# Altium schematic sheet GPIO_EXPANDER_LED.SchDoc: My title
size A3; Organization: University of California; Address1: 475 Portola Plaza; Address2: Los Angeles, CA 90095; DocumentNumber: 32; Revision: R01; SheetNumber: 32; SheetTotal: 35
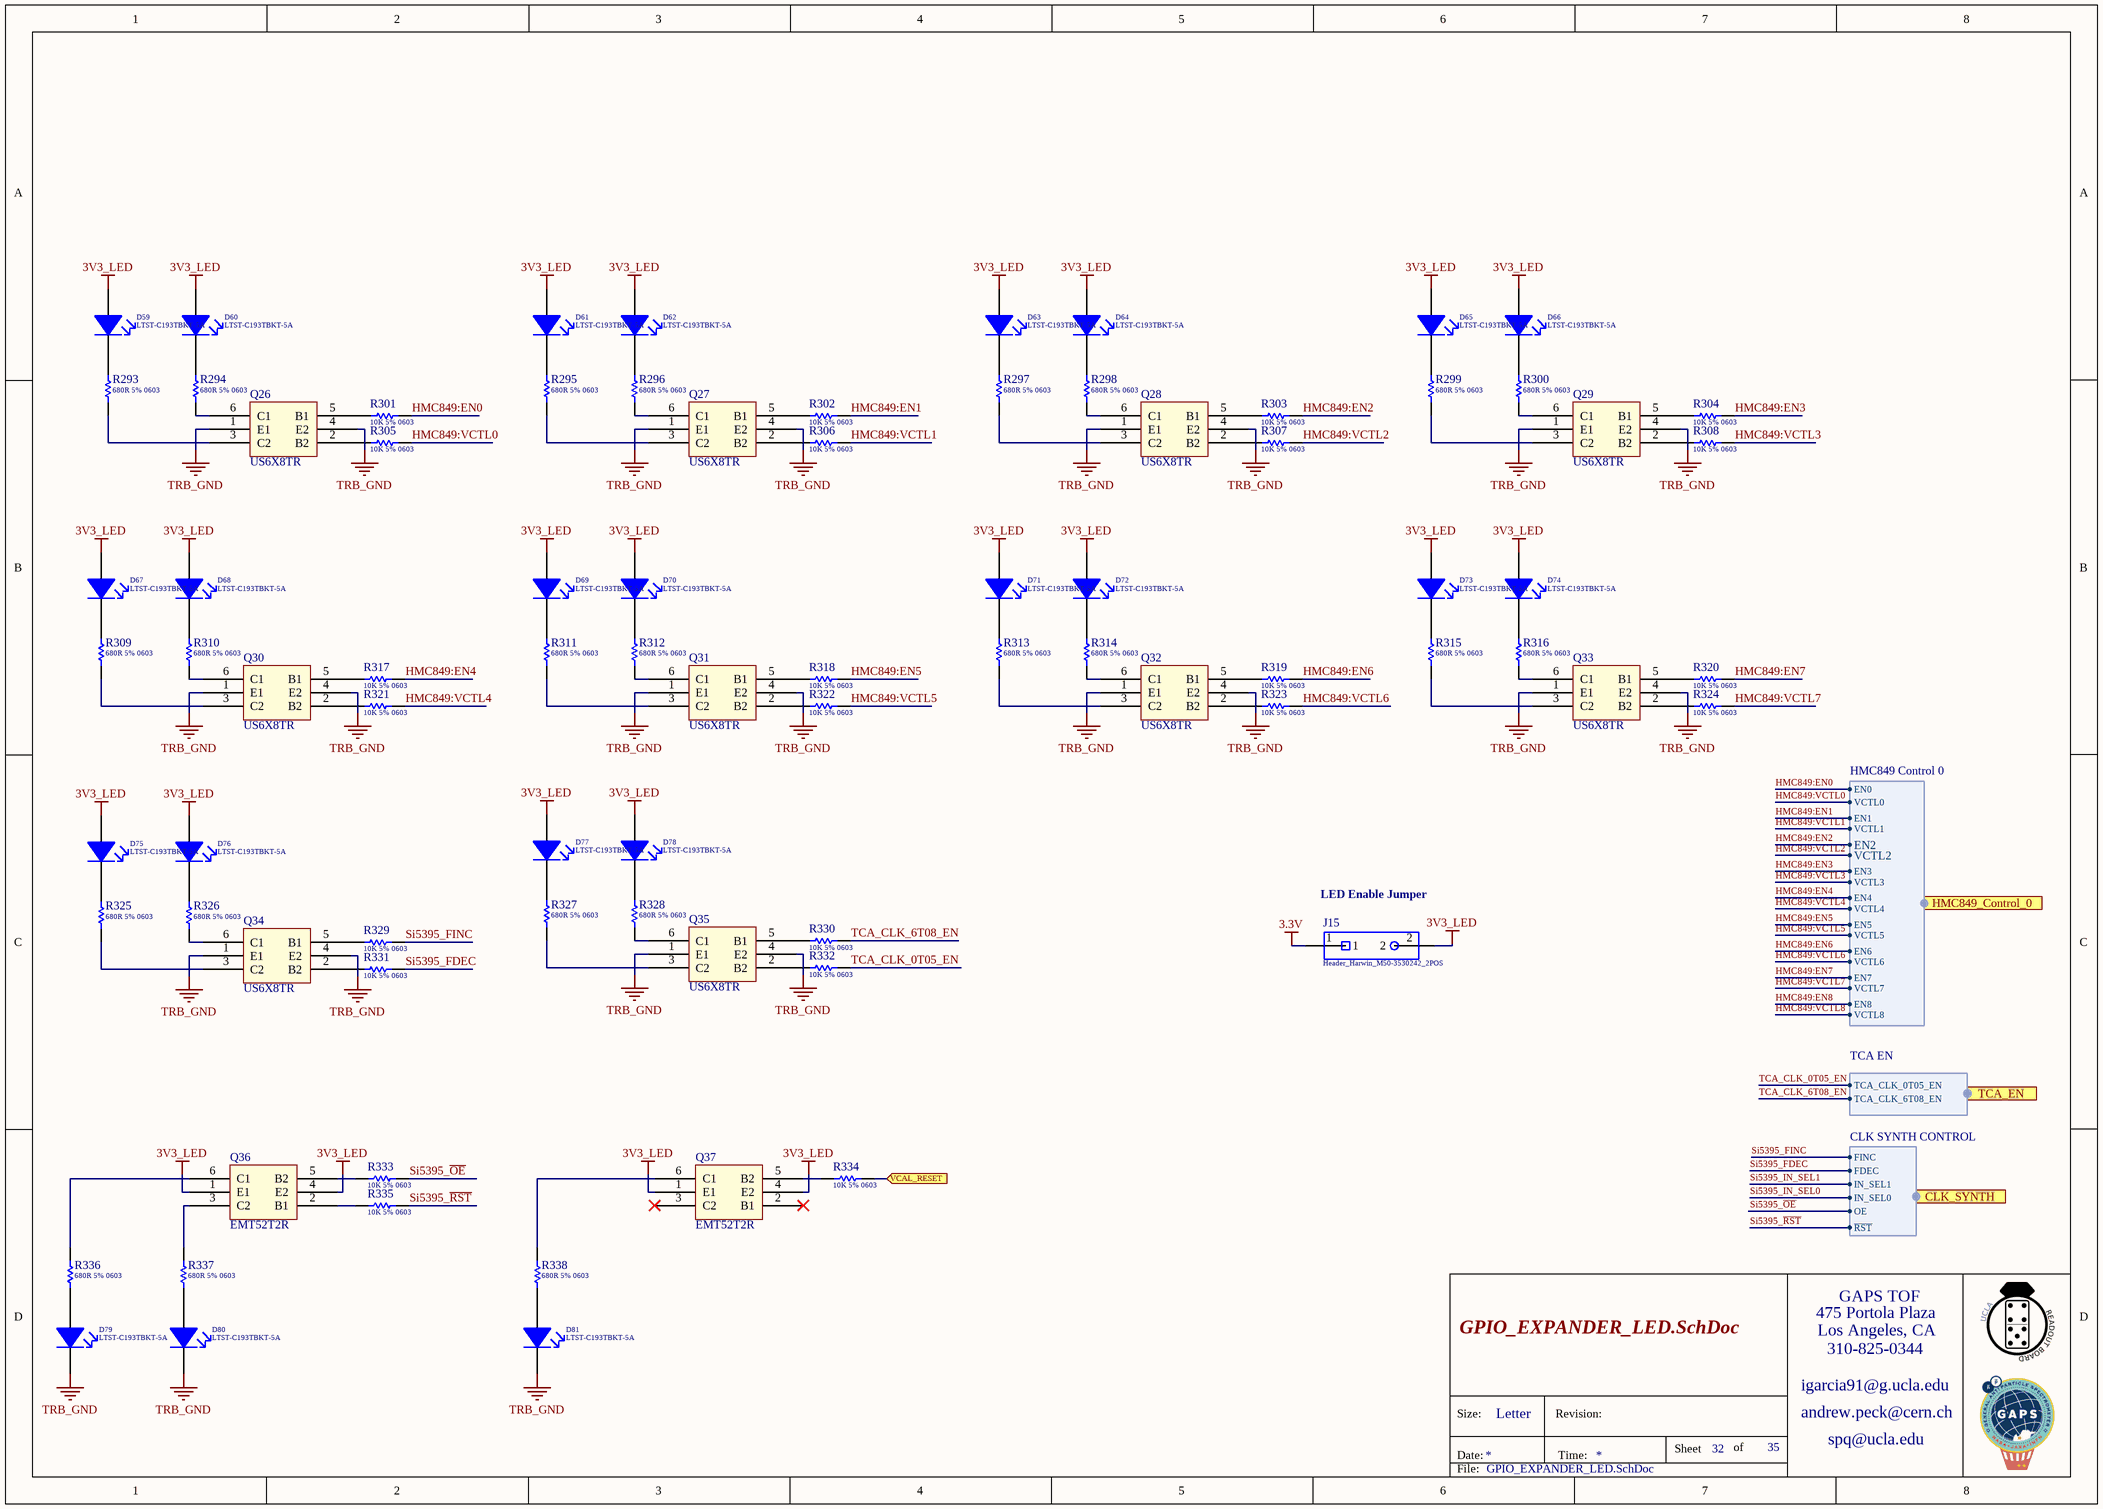
[diagram p0: GPIO_EXPANDER_LED.SchDoc]

## Parts
D59  Series: LTST-C193TBKT-5A  [Led_Lite-On_LTST-C193TBKT-5A_Blue]  (hidden comment: Led_Lite-On_LTST-C193TBKT-5A_Blue)
D60  Series: LTST-C193TBKT-5A  [Led_Lite-On_LTST-C193TBKT-5A_Blue]  (hidden comment: Led_Lite-On_LTST-C193TBKT-5A_Blue)
D61  Series: LTST-C193TBKT-5A  [Led_Lite-On_LTST-C193TBKT-5A_Blue]  (hidden comment: Led_Lite-On_LTST-C193TBKT-5A_Blue)
D62  Series: LTST-C193TBKT-5A  [Led_Lite-On_LTST-C193TBKT-5A_Blue]  (hidden comment: Led_Lite-On_LTST-C193TBKT-5A_Blue)
D63  Series: LTST-C193TBKT-5A  [Led_Lite-On_LTST-C193TBKT-5A_Blue]  (hidden comment: Led_Lite-On_LTST-C193TBKT-5A_Blue)
D64  Series: LTST-C193TBKT-5A  [Led_Lite-On_LTST-C193TBKT-5A_Blue]  (hidden comment: Led_Lite-On_LTST-C193TBKT-5A_Blue)
D65  Series: LTST-C193TBKT-5A  [Led_Lite-On_LTST-C193TBKT-5A_Blue]  (hidden comment: Led_Lite-On_LTST-C193TBKT-5A_Blue)
D66  Series: LTST-C193TBKT-5A  [Led_Lite-On_LTST-C193TBKT-5A_Blue]  (hidden comment: Led_Lite-On_LTST-C193TBKT-5A_Blue)
D67  Series: LTST-C193TBKT-5A  [Led_Lite-On_LTST-C193TBKT-5A_Blue]  (hidden comment: Led_Lite-On_LTST-C193TBKT-5A_Blue)
D68  Series: LTST-C193TBKT-5A  [Led_Lite-On_LTST-C193TBKT-5A_Blue]  (hidden comment: Led_Lite-On_LTST-C193TBKT-5A_Blue)
D69  Series: LTST-C193TBKT-5A  [Led_Lite-On_LTST-C193TBKT-5A_Blue]  (hidden comment: Led_Lite-On_LTST-C193TBKT-5A_Blue)
D70  Series: LTST-C193TBKT-5A  [Led_Lite-On_LTST-C193TBKT-5A_Blue]  (hidden comment: Led_Lite-On_LTST-C193TBKT-5A_Blue)
D71  Series: LTST-C193TBKT-5A  [Led_Lite-On_LTST-C193TBKT-5A_Blue]  (hidden comment: Led_Lite-On_LTST-C193TBKT-5A_Blue)
D72  Series: LTST-C193TBKT-5A  [Led_Lite-On_LTST-C193TBKT-5A_Blue]  (hidden comment: Led_Lite-On_LTST-C193TBKT-5A_Blue)
D73  Series: LTST-C193TBKT-5A  [Led_Lite-On_LTST-C193TBKT-5A_Blue]  (hidden comment: Led_Lite-On_LTST-C193TBKT-5A_Blue)
D74  Series: LTST-C193TBKT-5A  [Led_Lite-On_LTST-C193TBKT-5A_Blue]  (hidden comment: Led_Lite-On_LTST-C193TBKT-5A_Blue)
D75  Series: LTST-C193TBKT-5A  [Led_Lite-On_LTST-C193TBKT-5A_Blue]  (hidden comment: Led_Lite-On_LTST-C193TBKT-5A_Blue)
D76  Series: LTST-C193TBKT-5A  [Led_Lite-On_LTST-C193TBKT-5A_Blue]  (hidden comment: Led_Lite-On_LTST-C193TBKT-5A_Blue)
D77  Series: LTST-C193TBKT-5A  [Led_Lite-On_LTST-C193TBKT-5A_Blue]  (hidden comment: Led_Lite-On_LTST-C193TBKT-5A_Blue)
D78  Series: LTST-C193TBKT-5A  [Led_Lite-On_LTST-C193TBKT-5A_Blue]  (hidden comment: Led_Lite-On_LTST-C193TBKT-5A_Blue)
D79  Series: LTST-C193TBKT-5A  [Led_Lite-On_LTST-C193TBKT-5A_Blue]  (hidden comment: Led_Lite-On_LTST-C193TBKT-5A_Blue)
D80  Series: LTST-C193TBKT-5A  [Led_Lite-On_LTST-C193TBKT-5A_Blue]  (hidden comment: Led_Lite-On_LTST-C193TBKT-5A_Blue)
D81  Series: LTST-C193TBKT-5A  [Led_Lite-On_LTST-C193TBKT-5A_Blue]  (hidden comment: Led_Lite-On_LTST-C193TBKT-5A_Blue)
J15  Header_Harwin_M50-3530242_2POS  [Header_Harwin_M50-3530242_2POS]
Q26  Series: US6X8TR  [BJT_ROHM_US6X8TR_1A_NPN]  (hidden comment: BJT_ROHM_US6X8TR_1A_NPN)
Q27  Series: US6X8TR  [BJT_ROHM_US6X8TR_1A_NPN]  (hidden comment: BJT_ROHM_US6X8TR_1A_NPN)
Q28  Series: US6X8TR  [BJT_ROHM_US6X8TR_1A_NPN]  (hidden comment: BJT_ROHM_US6X8TR_1A_NPN)
Q29  Series: US6X8TR  [BJT_ROHM_US6X8TR_1A_NPN]  (hidden comment: BJT_ROHM_US6X8TR_1A_NPN)
Q30  Series: US6X8TR  [BJT_ROHM_US6X8TR_1A_NPN]  (hidden comment: BJT_ROHM_US6X8TR_1A_NPN)
Q31  Series: US6X8TR  [BJT_ROHM_US6X8TR_1A_NPN]  (hidden comment: BJT_ROHM_US6X8TR_1A_NPN)
Q32  Series: US6X8TR  [BJT_ROHM_US6X8TR_1A_NPN]  (hidden comment: BJT_ROHM_US6X8TR_1A_NPN)
Q33  Series: US6X8TR  [BJT_ROHM_US6X8TR_1A_NPN]  (hidden comment: BJT_ROHM_US6X8TR_1A_NPN)
Q34  Series: US6X8TR  [BJT_ROHM_US6X8TR_1A_NPN]  (hidden comment: BJT_ROHM_US6X8TR_1A_NPN)
Q35  Series: US6X8TR  [BJT_ROHM_US6X8TR_1A_NPN]  (hidden comment: BJT_ROHM_US6X8TR_1A_NPN)
Q36  Series: EMT52T2R  [BJT_ROHM_EMT52T2R_100mA_PNP]  (hidden comment: BJT_ROHM_EMT52T2R_100mA_PNP)
Q37  Series: EMT52T2R  [BJT_ROHM_EMT52T2R_100mA_PNP]  (hidden comment: BJT_ROHM_EMT52T2R_100mA_PNP)
R293  680R 5% 0603  [RESC0603(1608)_L]
R294  680R 5% 0603  [RESC0603(1608)_L]
R295  680R 5% 0603  [RESC0603(1608)_L]
R296  680R 5% 0603  [RESC0603(1608)_L]
R297  680R 5% 0603  [RESC0603(1608)_L]
R298  680R 5% 0603  [RESC0603(1608)_L]
R299  680R 5% 0603  [RESC0603(1608)_L]
R300  680R 5% 0603  [RESC0603(1608)_L]
R301  10K 5% 0603  [RESC0603(1608)_L]
R302  10K 5% 0603  [RESC0603(1608)_L]
R303  10K 5% 0603  [RESC0603(1608)_L]
R304  10K 5% 0603  [RESC0603(1608)_L]
R305  10K 5% 0603  [RESC0603(1608)_L]
R306  10K 5% 0603  [RESC0603(1608)_L]
R307  10K 5% 0603  [RESC0603(1608)_L]
R308  10K 5% 0603  [RESC0603(1608)_L]
R309  680R 5% 0603  [RESC0603(1608)_L]
R310  680R 5% 0603  [RESC0603(1608)_L]
R311  680R 5% 0603  [RESC0603(1608)_L]
R312  680R 5% 0603  [RESC0603(1608)_L]
R313  680R 5% 0603  [RESC0603(1608)_L]
R314  680R 5% 0603  [RESC0603(1608)_L]
R315  680R 5% 0603  [RESC0603(1608)_L]
R316  680R 5% 0603  [RESC0603(1608)_L]
R317  10K 5% 0603  [RESC0603(1608)_L]
R318  10K 5% 0603  [RESC0603(1608)_L]
R319  10K 5% 0603  [RESC0603(1608)_L]
R320  10K 5% 0603  [RESC0603(1608)_L]
R321  10K 5% 0603  [RESC0603(1608)_L]
R322  10K 5% 0603  [RESC0603(1608)_L]
R323  10K 5% 0603  [RESC0603(1608)_L]
R324  10K 5% 0603  [RESC0603(1608)_L]
R325  680R 5% 0603  [RESC0603(1608)_L]
R326  680R 5% 0603  [RESC0603(1608)_L]
R327  680R 5% 0603  [RESC0603(1608)_L]
R328  680R 5% 0603  [RESC0603(1608)_L]
R329  10K 5% 0603  [RESC0603(1608)_L]
R330  10K 5% 0603  [RESC0603(1608)_L]
R331  10K 5% 0603  [RESC0603(1608)_L]
R332  10K 5% 0603  [RESC0603(1608)_L]
R333  10K 5% 0603  [RESC0603(1608)_L]
R334  10K 5% 0603  [RESC0603(1608)_L]
R335  10K 5% 0603  [RESC0603(1608)_L]
R336  680R 5% 0603  [RESC0603(1608)_L]
R337  680R 5% 0603  [RESC0603(1608)_L]
R338  680R 5% 0603  [RESC0603(1608)_L]

## Ports
CLK_SYNTH (harness CLK SYNTH CONTROL), HMC849_Control_0 (harness HMC849 Control 0), TCA_EN (harness TCA EN), VCAL_RESET (in)

## Harnesses
HMC849 Control 0: EN0, VCTL0, EN1, VCTL1, EN2, VCTL2, EN3, VCTL3, EN4, VCTL4, EN5, VCTL5, EN6, VCTL6, EN7, VCTL7, EN8, VCTL8
TCA EN: TCA_CLK_0T05_EN, TCA_CLK_6T08_EN
CLK SYNTH CONTROL: ~{RST}, OE, IN_SEL0, IN_SEL1, FDEC, FINC

## Nets
3.3V: J15.1
3V3_LED: D59.2(A) D60.2(A) D61.2(A) D62.2(A) D63.2(A) D64.2(A) D65.2(A) D66.2(A) D67.2(A) D68.2(A) D69.2(A) D70.2(A) D71.2(A) D72.2(A) D73.2(A) D74.2(A) D75.2(A) D76.2(A) D77.2(A) D78.2(A) J15.2 Q36.1(E1) Q36.4(E2) Q37.1(E1) Q37.4(E2)
TRB_GND: D79.1(K) D80.1(K) D81.1(K) Q26.1(E1) Q26.4(E2) Q27.1(E1) Q27.4(E2) Q28.1(E1) Q28.4(E2) Q29.1(E1) Q29.4(E2) Q30.1(E1) Q30.4(E2) Q31.1(E1) Q31.4(E2) Q32.1(E1) Q32.4(E2) Q33.1(E1) Q33.4(E2) Q34.1(E1) Q34.4(E2) Q35.1(E1) Q35.4(E2)
HMC849:EN0: R301.2 ; port HMC849_Control_0.EN0
HMC849:EN1: R302.2 ; port HMC849_Control_0.EN1
HMC849:EN2: R303.2 ; port HMC849_Control_0.EN2
HMC849:EN3: R304.2 ; port HMC849_Control_0.EN3
HMC849:EN4: R317.2 ; port HMC849_Control_0.EN4
HMC849:EN5: R318.2 ; port HMC849_Control_0.EN5
HMC849:EN6: R319.2 ; port HMC849_Control_0.EN6
HMC849:EN7: R320.2 ; port HMC849_Control_0.EN7
HMC849:EN8: port HMC849_Control_0.EN8
HMC849:VCTL0: R305.1 ; port HMC849_Control_0.VCTL0
HMC849:VCTL1: R306.1 ; port HMC849_Control_0.VCTL1
HMC849:VCTL2: R307.1 ; port HMC849_Control_0.VCTL2
HMC849:VCTL3: R308.1 ; port HMC849_Control_0.VCTL3
HMC849:VCTL4: R321.1 ; port HMC849_Control_0.VCTL4
HMC849:VCTL5: R322.1 ; port HMC849_Control_0.VCTL5
HMC849:VCTL6: R323.1 ; port HMC849_Control_0.VCTL6
HMC849:VCTL7: R324.1 ; port HMC849_Control_0.VCTL7
HMC849:VCTL8: port HMC849_Control_0.VCTL8
Si5395_FDEC: R331.1 ; port CLK_SYNTH.FDEC
Si5395_FINC: R329.2 ; port CLK_SYNTH.FINC
Si5395_IN_SEL0: port CLK_SYNTH.IN_SEL0
Si5395_IN_SEL1: port CLK_SYNTH.IN_SEL1
Si5395_~{OE}: R333.1 ; port CLK_SYNTH.OE
Si5395_~{RST}: R335.2 ; port CLK_SYNTH.~{RST}
TCA_CLK_0T05_EN: R332.1 ; port TCA_EN.TCA_CLK_0T05_EN
TCA_CLK_6T08_EN: R330.2 ; port TCA_EN.TCA_CLK_6T08_EN
VCAL_RESET: R334.1 ; port VCAL_RESET
NetD59_1: D59.1(K) R293.2
NetD60_1: D60.1(K) R294.2
NetD61_1: D61.1(K) R295.2
NetD62_1: D62.1(K) R296.2
NetD63_1: D63.1(K) R297.2
NetD64_1: D64.1(K) R298.2
NetD65_1: D65.1(K) R299.2
NetD66_1: D66.1(K) R300.2
NetD67_1: D67.1(K) R309.2
NetD68_1: D68.1(K) R310.2
NetD69_1: D69.1(K) R311.2
NetD70_1: D70.1(K) R312.2
NetD71_1: D71.1(K) R313.2
NetD72_1: D72.1(K) R314.2
NetD73_1: D73.1(K) R315.2
NetD74_1: D74.1(K) R316.2
NetD75_1: D75.1(K) R325.2
NetD76_1: D76.1(K) R326.2
NetD77_1: D77.1(K) R327.2
NetD78_1: D78.1(K) R328.2
NetD79_2: D79.2(A) R336.1
NetD80_2: D80.2(A) R337.1
NetD81_2: D81.2(A) R338.1
NetQ26_2: Q26.2(B2) R305.2
NetQ26_3: Q26.3(C2) R293.1
NetQ26_5: Q26.5(B1) R301.1
NetQ26_6: Q26.6(C1) R294.1
NetQ27_2: Q27.2(B2) R306.2
NetQ27_3: Q27.3(C2) R295.1
NetQ27_5: Q27.5(B1) R302.1
NetQ27_6: Q27.6(C1) R296.1
NetQ28_2: Q28.2(B2) R307.2
NetQ28_3: Q28.3(C2) R297.1
NetQ28_5: Q28.5(B1) R303.1
NetQ28_6: Q28.6(C1) R298.1
NetQ29_2: Q29.2(B2) R308.2
NetQ29_3: Q29.3(C2) R299.1
NetQ29_5: Q29.5(B1) R304.1
NetQ29_6: Q29.6(C1) R300.1
NetQ30_2: Q30.2(B2) R321.2
NetQ30_3: Q30.3(C2) R309.1
NetQ30_5: Q30.5(B1) R317.1
NetQ30_6: Q30.6(C1) R310.1
NetQ31_2: Q31.2(B2) R322.2
NetQ31_3: Q31.3(C2) R311.1
NetQ31_5: Q31.5(B1) R318.1
NetQ31_6: Q31.6(C1) R312.1
NetQ32_2: Q32.2(B2) R323.2
NetQ32_3: Q32.3(C2) R313.1
NetQ32_5: Q32.5(B1) R319.1
NetQ32_6: Q32.6(C1) R314.1
NetQ33_2: Q33.2(B2) R324.2
NetQ33_3: Q33.3(C2) R315.1
NetQ33_5: Q33.5(B1) R320.1
NetQ33_6: Q33.6(C1) R316.1
NetQ34_2: Q34.2(B2) R331.2
NetQ34_3: Q34.3(C2) R325.1
NetQ34_5: Q34.5(B1) R329.1
NetQ34_6: Q34.6(C1) R326.1
NetQ35_2: Q35.2(B2) R332.2
NetQ35_3: Q35.3(C2) R327.1
NetQ35_5: Q35.5(B1) R330.1
NetQ35_6: Q35.6(C1) R328.1
NetQ36_2: Q36.2(B1) R335.1
NetQ36_3: Q36.3(C2) R337.2
NetQ36_5: Q36.5(B2) R333.2
NetQ36_6: Q36.6(C1) R336.2
NetQ37_5: Q37.5(B2) R334.2
NetQ37_6: Q37.6(C1) R338.2

Not connected (* = marked no-connect by the designer): Q37 2(B1)* 3(C2)*

## Notes on the sheet
- (near J15) LED Enable Jumper
- 475 Portola Plaza
- GAPS TOF
- igarcia91@g.ucla.edu
- Los Angeles, CA
- 310-825-0344
- Size:
- Date:
- Letter
- Revision:
- Time:
- Sheet
- of
- andrew.peck@cern.ch
- spq@ucla.edu
- File:

## Library data of the parts
D59-D81 = Led_Lite-On_LTST-C193TBKT-5A_Blue: Standard LEDs - SMD Blue 470nm 28mcd 20mA; Supplier 1: Mouser; Supplier Part Number 1: 859-LTSTC193TBKT5A
J15 = Header_Harwin_M50-3530242_2POS: Headers & Wire Housings 2 WAY SIL VERT PC TAIL P/HDR; Supplier 1: Mouser; Supplier Part Number 1: 855-M50-3530242
Q26-Q35 = BJT_ROHM_US6X8TR_1A_NPN: Bipolar Transistors - BJT NPN+NPN 30VCEO 1A SOT-363T; Manufacturer 1: ROHM; Supplier Part Number 1: 755-US6X8TR; Supplier 1: Mouser; Manufacturer Part Number 1: US6X8TR
Q36 Q37 = BJT_ROHM_EMT52T2R_100mA_PNP: Bipolar Transistors - BJT Bipolar Transistor SOT-563 SC-107C EMT6; Manufacturer 1: ROHM; Supplier 1: Mouser; Supplier Part Number 1: 755-EMT52T2R; Manufacturer Part Number 1: EMT52T2R
R293-R300 R309-R316 R325-R328 R336-R338 = CMP-1012-00070-1: 680R 0.1W 5% 0603 (1608 Metric)  SMD; Case-EIA: 0603; Value: 680.00 Ohm; Case-Metric: 1608; Tolerance: 5 %; Technology: SMT; Power: 0.1 W
R301-R308 R317-R324 R329-R335 = CMP-1012-00098-1: 10K 0.1W 5% 0603 (1608 Metric)  SMD; Case-EIA: 0603; Value: 10000.00 Ohm; Case-Metric: 1608; Technology: SMT; Tolerance: 5 %; Power: 0.1 W